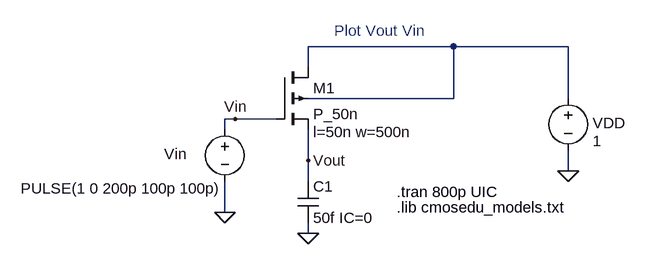
[diagram p0: schematic Fig10_12_PMOS_short.asc]
Fig10_12_PMOS_short.asc, the LTspice schematic file:
Version 4
SHEET 1 1224 688
WIRE 320 208 320 192
WIRE 320 336 320 288
WIRE 336 192 320 192
WIRE 400 192 336 192
WIRE 448 112 448 80
WIRE 448 256 448 208
WIRE 448 288 448 256
WIRE 448 368 448 352
WIRE 672 80 448 80
WIRE 672 160 448 160
WIRE 672 160 672 80
WIRE 848 80 672 80
WIRE 848 160 848 80
WIRE 848 272 848 240
FLAG 848 272 0
FLAG 320 336 0
FLAG 336 192 Vin
FLAG 448 368 0
FLAG 448 256 Vout
SYMBOL voltage 320 192 R0
WINDOW 0 -93 54 Left 0
WINDOW 3 -314 107 Left 0
WINDOW 123 0 0 Left 0
WINDOW 39 0 0 Left 0
SYMATTR InstName Vin
SYMATTR Value PULSE(1 0 200p 100p 100p)
SYMBOL pmos4 400 112 R0
WINDOW 123 56 100 Left 0
SYMATTR Value2 l=50n w=500n
SYMATTR InstName M1
SYMATTR Value P_50n
SYMBOL voltage 848 144 R0
WINDOW 123 0 0 Left 0
WINDOW 39 0 0 Left 0
WINDOW 0 38 54 Left 0
WINDOW 3 38 82 Left 0
SYMATTR InstName VDD
SYMATTR Value 1
SYMBOL cap 432 288 R0
SYMATTR InstName C1
SYMATTR Value 50f IC=0
TEXT 584 304 Left 0 !.tran 800p UIC
TEXT 584 328 Left 0 !.lib cmosedu_models.txt
TEXT 488 56 Left 0 ;Plot Vout Vin

The netlist it stands for:
* Fig10_12_PMOS_short.asc
Vin Vin 0 PULSE(1 0 200p 100p 100p)
M1 N001 Vin Vout N001 P_50n l=50n w=500n
VDD N001 0 1
C1 Vout 0 50f IC=0
.model NMOS NMOS
.model PMOS PMOS
.lib standard.mos
.tran 800p UIC
.lib cmosedu_models.txt
* Plot Vout Vin
.backanno
.end